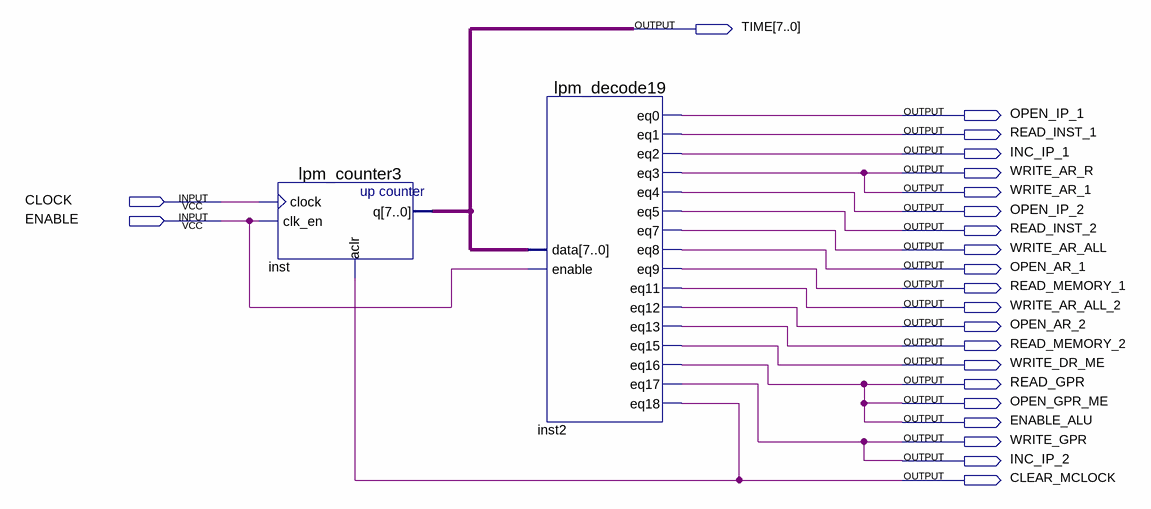
[diagram p0: schematic sheet]
// Quartus schematic XOR_REG_lADRl.bdf as structural Verilog: 2 symbols, 23 pins
module XOR_REG_lADRl (
  input  CLOCK,
  input  ENABLE,
  output [7:0] TIME,
  output OPEN_IP_1,
  output READ_INST_1,
  output INC_IP_1,
  output WRITE_AR_R,
  output WRITE_AR_1,
  output OPEN_IP_2,
  output READ_INST_2,
  output WRITE_AR_ALL,
  output OPEN_AR_1,
  output READ_MEMORY_1,
  output WRITE_AR_ALL_2,
  output OPEN_AR_2,
  output READ_MEMORY_2,
  output WRITE_DR_ME,
  output READ_GPR,
  output OPEN_GPR_ME,
  output ENABLE_ALU,
  output WRITE_GPR,
  output INC_IP_2,
  output CLEAR_MCLOCK
);

  lpm_counter3 inst (.clock(CLOCK), .clk_en(ENABLE), .aclr(CLEAR_MCLOCK), .q(TIME));
  lpm_decode19 inst2 (
    .data(TIME), .enable(ENABLE), .eq0(OPEN_IP_1), .eq1(READ_INST_1), .eq2(INC_IP_1), .eq3(WRITE_AR_1),
    .eq4(OPEN_IP_2), .eq5(READ_INST_2), .eq7(WRITE_AR_ALL), .eq8(OPEN_AR_1), .eq9(READ_MEMORY_1),
    .eq11(WRITE_AR_ALL_2), .eq12(OPEN_AR_2), .eq13(READ_MEMORY_2), .eq15(WRITE_DR_ME), .eq16(ENABLE_ALU),
    .eq17(INC_IP_2), .eq18(CLEAR_MCLOCK));

  assign OPEN_GPR_ME = ENABLE_ALU;
  assign READ_GPR = ENABLE_ALU;
  assign WRITE_AR_R = WRITE_AR_1;
  assign WRITE_GPR = INC_IP_2;
endmodule
